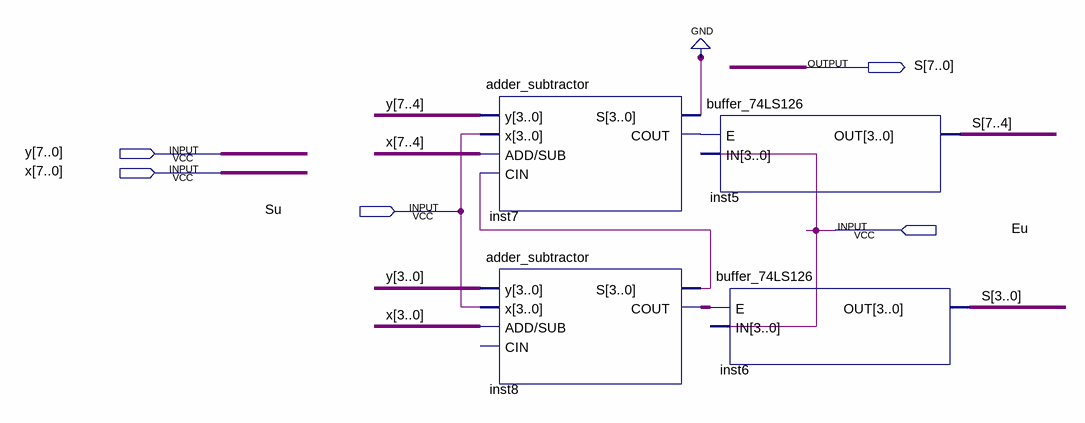
[diagram p0: schematic sheet]
// Quartus schematic adders_in_chain.bdf as structural Verilog: 4 symbols, 5 pins
module adders_in_chain (
  input  [7:0] y,
  input  [7:0] x,
  input  Su,
  input  Eu,
  output [7:0] S
);

  wire inst7_cout, inst7_s, inst8_cout, inst8_s;

  adder_subtractor inst7 (.y(y[7:4]), .x({4{Su}}), .\ADD/SUB (x[7:4]), .CIN(inst8_s), .S(inst7_s), .COUT(inst7_cout));
  adder_subtractor inst8 (.y(y[3:0]), .x({4{Su}}), .\ADD/SUB (x[3:0]), .S(inst8_s), .COUT(inst8_cout));  // open: CIN
  buffer_74LS126 inst5 (.E(inst7_cout), .IN({4{Eu}}), .OUT(S[7:4]));
  buffer_74LS126 inst6 (.E(inst8_cout), .IN({4{Eu}}), .OUT(S[3:0]));
  // also tied to GND on the sheet: inst7_s
endmodule
